# Altium project Conv-Comp.PrjPCB
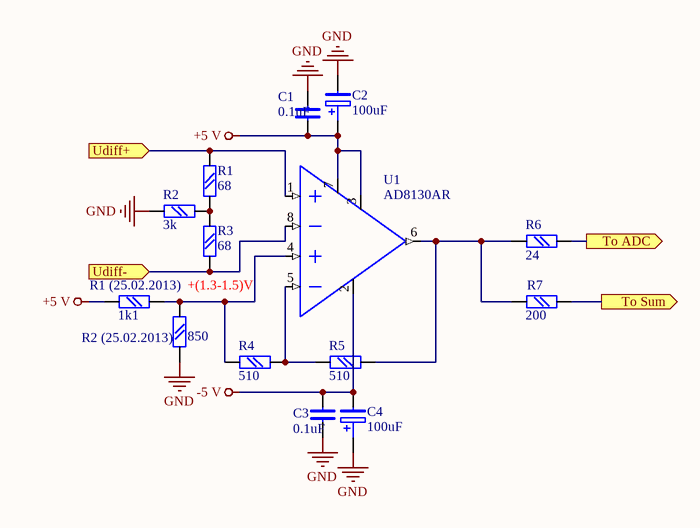
[diagram p0: Converter_Dif-Se.SchDoc]
3 sheets, 39 parts. Net scope: flat (ports and power ports of the same name join across sheets).
Board file: Conv-Comp_v.2.PCBDOC
Sheets:
  Converter_Dif-Se.SchDoc
  Sum-Comp.SchDoc
  IN-OUT.SchDoc

## Sheet Converter_Dif-Se.SchDoc
size A

### Parts
C1  0.1uF  [chip0805]
C2  100uF  [CEL-SMD300]
C3  0.1uF  [chip0805]
C4  100uF  [CEL-SMD300]
R1  68  [chip0805]
R1_(25.02.2013)  1k1  [chip0805]
R2  3k  [chip0805]
R2_(25.02.2013)  850  [chip0805]
R3  68  [chip0805]
R4  510  [chip0805]
R5  510  [chip0805]
R6  24  [chip0805]
R7  200  [chip0805]
U1  AD8130AR  [SO-8]

### Ports
To ADC (out), To Sum (out), Udiff+ (in), Udiff- (in)

### Nets
+5 V: C1.2 C2.+ R1_(25.02.2013).2 U1.3(PD) U1.7(E+)
-5 V: C3.1 C4.- U1.2(E-)
GND: C1.1 C2.- C3.2 C4.+ R2.2 R2_(25.02.2013).1
NetR1_1: R1.1 U1.1(+IN) ; port Udiff+
NetR1_2: R1.2 R2.1 R3.1
NetR1_(25.02.2013)_1: R1_(25.02.2013).1 R2_(25.02.2013).2 R4.2 U1.4(IN+)
NetR3_2: R3.2 U1.8(-IN) ; port Udiff-
NetR4_1: R4.1 R5.1 U1.5(IN-)
NetR5_2: R5.2 R6.1 R7.1 U1.6(OUT)
NetR6_2: R6.2 ; port To ADC
NetR7_2: R7.2 ; port To Sum

### Notes on the sheet
- +(1.3-1.5)V

### Library data of the parts
C1 C3 = C: Text Field1: 20; Text Field2: 10
C2 C4 = C POL: Text Field1: 20; Text Field2: 20
R1 R1_(25.02.2013) R2 R2_(25.02.2013) R3-R7 = R: Text Field1: 20; Text Field2: 20
U1 = AD8130

## Sheet Sum-Comp.SchDoc
size A
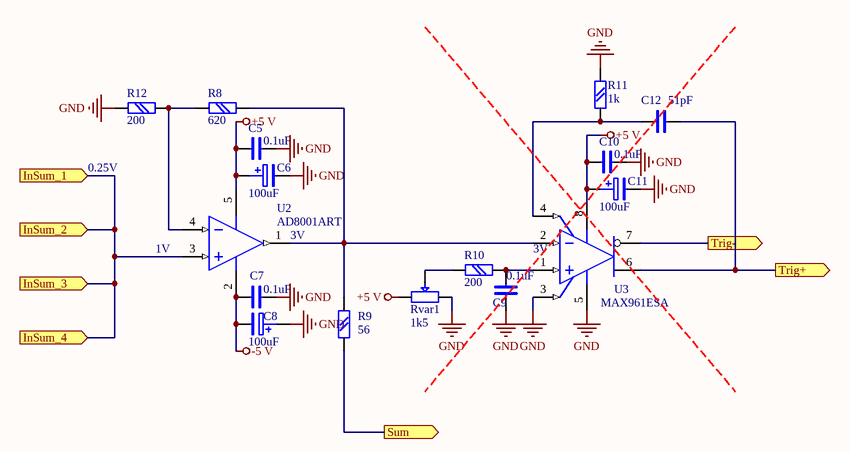
[diagram p1: Sum-Comp.SchDoc]

### Parts
C5  0.1uF  [chip0805]
C6  100uF  [CEL-SMD300]
C7  0.1uF  [chip0805]
C8  100uF  [CEL-SMD300]
C9  0.1uF  [chip0805]
C10  0.1uF  [chip0805]
C11  100uF  [CEL-SMD300]
C12  51pF  [chip0805]
R8  620  [chip0805]
R9  56  [chip0805]
R10  200  [chip0805]
R11  1k  [chip0805]
R12  200  [chip0805]
Rvar1  1k5  [RVAR4]
U2  AD8001ART  [RT-5]
U3  MAX961ESA  [NSO8_N]

### Ports
InSum_1 (in), InSum_2 (in), InSum_3 (in), InSum_4 (in), Sum (out), Trig+ (out), Trig- (out)

### Nets
+5 V: C5.2 C6.+ C10.2 C11.+ Rvar1.1 U2.5(V+) U3.8(V+)
-5 V: C7.2 C8.- U2.2(V-)
GND: C5.1 C6.- C7.1 C8.+ C9.1 C10.1 C11.- R11.2 R12.2 Rvar1.3 U3.3(SHDN) U3.5(GND)
NetC9_2: C9.2 R10.2 U3.1(IN+)
NetC12_1: C12.1 R11.1 U3.4(LE)
NetC12_2: C12.2 U3.6(Q) ; port Trig+
NetR8_1: R8.1 R12.1 U2.4(IN-)
NetR8_2: R8.2 R9.2 U2.1(OUT) U3.2(IN-)
NetR9_1: R9.1 ; port Sum
NetR10_1: R10.1 Rvar1.2
NetU2_3: U2.3(IN+) ; port InSum_1, port InSum_2, port InSum_3, port InSum_4
NetU3_7: U3.7(~{Q}) ; port Trig-

### Notes on the sheet
- 0.25V
- (near U2) 1V
- (near U2) 3V
- (near U3) 3V

### Library data of the parts
C5 C7 C9 C10 C12 = C: Text Field1: 20; Text Field2: 10
C6 C8 C11 = C POL: Text Field1: 20; Text Field2: 20
R8-R12 = R: Text Field1: 20; Text Field2: 20
Rvar1 = R VAR: Text Field1: 20; Text Field2: 20
U2 = AD8055ART: Low Cost, 300MHz Voltage Feedback Amplifier; Published: 8-Jun-2000; LatestRevisionDate: 17-Jul-2002; LatestRevisionNote: Re-released for DXP Platform.; DatasheetVersion: REV. 0 1997; PackageReference: RT-5; Publisher: Altium Limited; PackageDescription: SOT-23/SC-74A; 5 Leads; Body 3.1 x 3 mm, inc. leads (LxW max); Code_JEDEC: MO-178AA; ComponentLink1Description: Manufacturer Link; ComponentLink1URL: http://www.analog.com/en/prod/0,,759_786_AD8055%2C00.html; ComponentLink2Description: Datasheet; ComponentLink2URL: http://www.analog.com/UploadedFiles/Data_Sheets/40402558757264AD8055_6_i.pdf
U3 = MAX961ESA: Single Ultra-High-Speed, +3V/+5V, Beyond-the-Rails Comparator; Published: 16-Jan-2001; LatestRevisionDate: 13-Apr-2006; LatestRevisionNote: IPC-7351 Footprint Added.; DatasheetVersion: Jan-1998; PackageReference: NSO8; Publisher: Altium Limited; PackageDescription: 8-Pin Small Outline Integrated Circuit 1.27 mm Pitch; Code_JEDEC: MS-012-AA; Code_IPC: SOIC127P600-8; ComponentLink1Description: Manufacturer Link; ComponentLink1URL: http://www.maxim-ic.com/; ComponentLink2Description: Datasheet; ComponentLink2URL: http://pdfserv.maxim-ic.com/en/ds/MAX961-MAX999.pdf

## Sheet IN-OUT.SchDoc
size A4
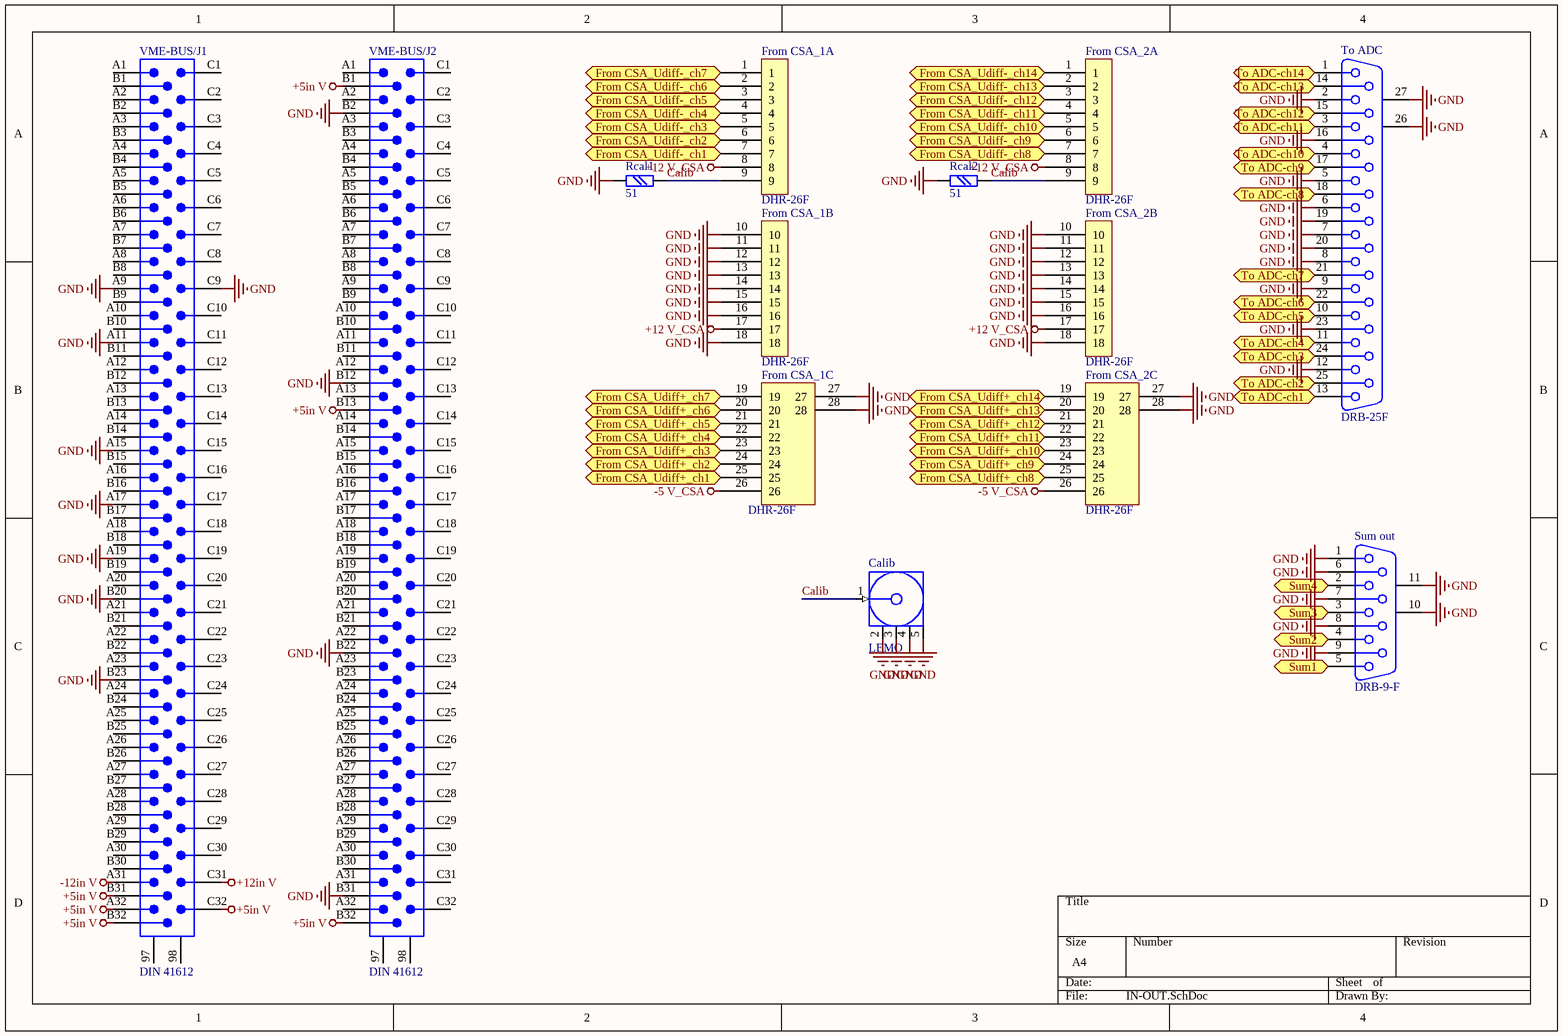
[diagram p2: IN-OUT.SchDoc]

### Parts
Calib  LEMO  [LEMO]
From_CSA_1  DHR-26F  [DHR-F-26]  (parts A,B,C of 3)
From_CSA_2  DHR-26F  [DHR-F-26]  (parts A,B,C of 3)
Rcal1  51  [chip0805]
Rcal2  51  [chip0805]
Sum_out  DRB-9-F  [DSUB1.385-2H9]
To_ADC  DRB-25F  [DSUB1.385-2H25A]
VME-BUS/J1  DIN 41612  [EURO2.54-2H96]
VME-BUS/J2  DIN 41612  [EURO2.54-2H96]

### Ports
From CSA_Udiff+_ch1 (in), From CSA_Udiff+_ch2 (in), From CSA_Udiff+_ch3 (in), From CSA_Udiff+_ch4 (in), From CSA_Udiff+_ch5 (in), From CSA_Udiff+_ch6 (in), From CSA_Udiff+_ch7 (in), From CSA_Udiff+_ch8 (in), From CSA_Udiff+_ch9 (in), From CSA_Udiff+_ch10 (in), From CSA_Udiff+_ch11 (in), From CSA_Udiff+_ch12 (in), From CSA_Udiff+_ch13 (in), From CSA_Udiff+_ch14 (in), From CSA_Udiff-_ch1 (in), From CSA_Udiff-_ch2 (in), From CSA_Udiff-_ch3 (in), From CSA_Udiff-_ch4 (in), From CSA_Udiff-_ch5 (in), From CSA_Udiff-_ch6 (in), From CSA_Udiff-_ch7 (in), From CSA_Udiff-_ch8 (in), From CSA_Udiff-_ch9 (in), From CSA_Udiff-_ch10 (in), From CSA_Udiff-_ch11 (in), From CSA_Udiff-_ch12 (in), From CSA_Udiff-_ch13 (in), From CSA_Udiff-_ch14 (in), Sum1 (in), Sum2 (in), Sum3 (in), Sum4 (in), To ADC-ch1 (in), To ADC-ch2 (in), To ADC-ch3 (in), To ADC-ch4 (in), To ADC-ch5 (in), To ADC-ch6 (in), To ADC-ch7 (in), To ADC-ch8 (in), To ADC-ch9 (in), To ADC-ch10 (in), To ADC-ch11 (in), To ADC-ch12 (in), To ADC-ch13 (in), To ADC-ch14 (in)

### Nets
+5in V: VME-BUS/J1.A32 VME-BUS/J1.B31 VME-BUS/J1.B32 VME-BUS/J1.C32 VME-BUS/J2.B1 VME-BUS/J2.B13 VME-BUS/J2.B32
+12 V_CSA: From_CSA_1.8 From_CSA_1.17 From_CSA_2.8 From_CSA_2.17
+12in V: VME-BUS/J1.C31
-5 V_CSA: From_CSA_1.26 From_CSA_2.26
-12in V: VME-BUS/J1.A31
GND: Calib.2(GND) Calib.3(GND) Calib.4(GND) Calib.5(GND) From_CSA_1.10 From_CSA_1.11 From_CSA_1.12 From_CSA_1.13 From_CSA_1.14 From_CSA_1.15 From_CSA_1.16 From_CSA_1.18 From_CSA_1.27 From_CSA_1.28 From_CSA_2.10 From_CSA_2.11 From_CSA_2.12 From_CSA_2.13 From_CSA_2.14 From_CSA_2.15 From_CSA_2.16 From_CSA_2.18 From_CSA_2.27 From_CSA_2.28 Rcal1.2 Rcal2.2 Sum_out.1 Sum_out.6 Sum_out.7 Sum_out.8 Sum_out.9 Sum_out.10(MH1) Sum_out.11(MH2) To_ADC.2 To_ADC.5 To_ADC.6 To_ADC.7 To_ADC.8 To_ADC.9 To_ADC.12 To_ADC.16 To_ADC.19 To_ADC.20 To_ADC.23 To_ADC.26(MH1) To_ADC.27(MH2) VME-BUS/J1.A9 VME-BUS/J1.A11 VME-BUS/J1.A15 VME-BUS/J1.A17 VME-BUS/J1.A19 VME-BUS/J1.B20 VME-BUS/J1.B23 VME-BUS/J1.C9 VME-BUS/J2.B2 VME-BUS/J2.B12 VME-BUS/J2.B22 VME-BUS/J2.B31
Calib: Calib.1(Signal) From_CSA_1.9 From_CSA_2.9 Rcal1.1 Rcal2.1
NetFrom_CSA_1_1: From_CSA_1.1 ; port From CSA_Udiff-_ch7
NetFrom_CSA_1_2: From_CSA_1.2 ; port From CSA_Udiff-_ch6
NetFrom_CSA_1_3: From_CSA_1.3 ; port From CSA_Udiff-_ch5
NetFrom_CSA_1_4: From_CSA_1.4 ; port From CSA_Udiff-_ch4
NetFrom_CSA_1_5: From_CSA_1.5 ; port From CSA_Udiff-_ch3
NetFrom_CSA_1_6: From_CSA_1.6 ; port From CSA_Udiff-_ch2
NetFrom_CSA_1_7: From_CSA_1.7 ; port From CSA_Udiff-_ch1
NetFrom_CSA_1_19: From_CSA_1.19 ; port From CSA_Udiff+_ch7
NetFrom_CSA_1_20: From_CSA_1.20 ; port From CSA_Udiff+_ch6
NetFrom_CSA_1_21: From_CSA_1.21 ; port From CSA_Udiff+_ch5
NetFrom_CSA_1_22: From_CSA_1.22 ; port From CSA_Udiff+_ch4
NetFrom_CSA_1_23: From_CSA_1.23 ; port From CSA_Udiff+_ch3
NetFrom_CSA_1_24: From_CSA_1.24 ; port From CSA_Udiff+_ch2
NetFrom_CSA_1_25: From_CSA_1.25 ; port From CSA_Udiff+_ch1
NetFrom_CSA_2_1: From_CSA_2.1 ; port From CSA_Udiff-_ch14
NetFrom_CSA_2_2: From_CSA_2.2 ; port From CSA_Udiff-_ch13
NetFrom_CSA_2_3: From_CSA_2.3 ; port From CSA_Udiff-_ch12
NetFrom_CSA_2_4: From_CSA_2.4 ; port From CSA_Udiff-_ch11
NetFrom_CSA_2_5: From_CSA_2.5 ; port From CSA_Udiff-_ch10
NetFrom_CSA_2_6: From_CSA_2.6 ; port From CSA_Udiff-_ch9
NetFrom_CSA_2_7: From_CSA_2.7 ; port From CSA_Udiff-_ch8
NetFrom_CSA_2_19: From_CSA_2.19 ; port From CSA_Udiff+_ch14
NetFrom_CSA_2_20: From_CSA_2.20 ; port From CSA_Udiff+_ch13
NetFrom_CSA_2_21: From_CSA_2.21 ; port From CSA_Udiff+_ch12
NetFrom_CSA_2_22: From_CSA_2.22 ; port From CSA_Udiff+_ch11
NetFrom_CSA_2_23: From_CSA_2.23 ; port From CSA_Udiff+_ch10
NetFrom_CSA_2_24: From_CSA_2.24 ; port From CSA_Udiff+_ch9
NetFrom_CSA_2_25: From_CSA_2.25 ; port From CSA_Udiff+_ch8
NetSum_out_2: Sum_out.2 ; port Sum4
NetSum_out_3: Sum_out.3 ; port Sum3
NetSum_out_4: Sum_out.4 ; port Sum2
NetSum_out_5: Sum_out.5 ; port Sum1
NetTo_ADC_1: To_ADC.1 ; port To ADC-ch14
NetTo_ADC_3: To_ADC.3 ; port To ADC-ch11
NetTo_ADC_4: To_ADC.4 ; port To ADC-ch10
NetTo_ADC_10: To_ADC.10 ; port To ADC-ch5
NetTo_ADC_11: To_ADC.11 ; port To ADC-ch4
NetTo_ADC_13: To_ADC.13 ; port To ADC-ch1
NetTo_ADC_14: To_ADC.14 ; port To ADC-ch13
NetTo_ADC_15: To_ADC.15 ; port To ADC-ch12
NetTo_ADC_17: To_ADC.17 ; port To ADC-ch9
NetTo_ADC_18: To_ADC.18 ; port To ADC-ch8
NetTo_ADC_21: To_ADC.21 ; port To ADC-ch7
NetTo_ADC_22: To_ADC.22 ; port To ADC-ch6
NetTo_ADC_24: To_ADC.24 ; port To ADC-ch3
NetTo_ADC_25: To_ADC.25 ; port To ADC-ch2

Not connected (* = marked no-connect by the designer): VME-BUS/J1 97 98 A1 A2 A3 A4 A5 A6 A7 A8 A10 A12 A13 A14 A16 A18 A20 A21 A22 A23 A24 A25 A26 A27 A28 A29 A30 B1 B2 B3 B4 B5 B6 B7 B8 B9 B10 B11 B12 B13 B14 B15 B16 B17 B18 B19 B21 B22 B24 B25 B26 B27 B28 B29 B30 C1 C2 C3 C4 C5 C6 C7 C8 C10 C11 C12 C13 C14 C15 C16 C17 C18 C19 C20 C21 C22 C23 C24 C25 C26 C27 C28 C29 C30; VME-BUS/J2 97 98 A1 A2 A3 A4 A5 A6 A7 A8 A9 A10 A11 A12 A13 A14 A15 A16 A17 A18 A19 A20 A21 A22 A23 A24 A25 A26 A27 A28 A29 A30 A31 A32 B3 B4 B5 B6 B7 B8 B9 B10 B11 B14 B15 B16 B17 B18 B19 B20 B21 B23 B24 B25 B26 B27 B28 B29 B30 C1 C2 C3 C4 C5 C6 C7 C8 C9 C10 C11 C12 C13 C14 C15 C16 C17 C18 C19 C20 C21 C22 C23 C24 C25 C26 C27 C28 C29 C30 C31 C32

### Library data of the parts
Calib = COAX-F: RF Coaxial PCB Connector, MCX; Thru-Hole, Right-Angle Mount Socket, Blunt Post Terminal, 50 Ohm Impedance; PCB_Layout: Complies with manufacturer's recommendation.; DrillSize: Corresponds to nominal value.; Published: 15-Jul-2004; LatestRevisionDate: 15-Jul-2004; LatestRevisionNote: Component Replaced.; DatasheetDocument: 30-May-2003; PackageDocument: 04-Jul-1999; PackageReference: 919-119J-51AX; Publisher: Altium Limited; ComponentLink1Description: Manufacturer Link; ComponentLink1URL: http://www.amphenolrf.com/
Rcal1 Rcal2 = R: Text Field1: 20; Text Field2: 20
Sum_out = D Connector 9: Receptacle Assembly, 9 Position, Right Angle; PackageDocument: O; Positions: 9; Published: 15-Jun-2001; LatestRevisionDate: 17-Jul-2002; LatestRevisionNote: Re-released for DXP Platform.; DatasheetDocument: 1-Sep-1999; PackageReference: 788750; Publisher: Altium Limited; Orientation: Right Angle; Gender: Receptacle
To_ADC = D Connector 25: Receptacle Assembly, 25 Position, Right Angle; PackageDocument: U; Positions: 25; Published: 15-Jun-2001; LatestRevisionDate: 17-Jul-2002; LatestRevisionNote: Re-released for DXP Platform.; DatasheetDocument: 19-Mar-1999; PackageReference: 787202; Publisher: Altium Limited; Orientation: Right Angle; Gender: Receptacle
VME-BUS/J1 VME-BUS/J2 = CNVME96: 96-Pin Connector (3x32 2.54mm grid); Text Field6: Alternate Layout Available; Text Field7: Published 14-Feb-2002

## Nets that join several sheets
+5 V: Converter_Dif-Se (5 pins), Sum-Comp (7 pins)
-5 V: Converter_Dif-Se (C3.1 C4.- U1.2), Sum-Comp (C7.2 C8.- U2.2)
GND: Converter_Dif-Se (6 pins), Sum-Comp (12 pins), IN-OUT (58 pins)